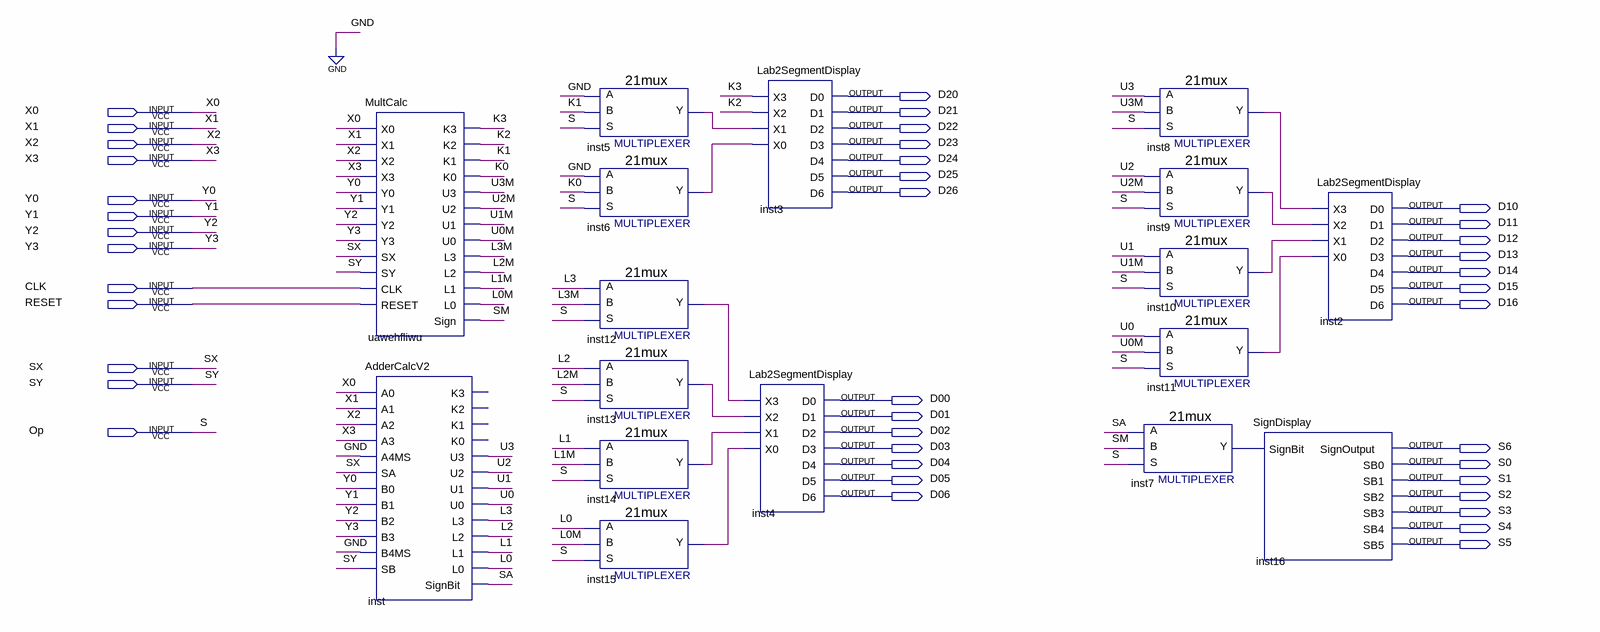
[diagram p0: schematic sheet]
// Quartus schematic CalculatorDisplay.bdf as structural Verilog: 17 symbols, 41 pins
module CalculatorDisplay (
  input  X0,
  input  X1,
  input  X2,
  input  X3,
  input  Y0,
  input  Y1,
  input  Y2,
  input  Y3,
  input  CLK,
  input  RESET,
  input  SX,
  input  SY,
  input  Op,
  output D20,
  output D21,
  output D22,
  output D23,
  output D24,
  output D25,
  output D26,
  output D10,
  output D11,
  output D12,
  output D13,
  output D14,
  output D15,
  output D16,
  output D00,
  output D01,
  output D02,
  output D03,
  output S6,
  output D04,
  output S0,
  output D05,
  output S1,
  output D06,
  output S2,
  output S3,
  output S4,
  output S5
);

  wire inst5_y, inst6_y, inst7_y, inst8_y, inst9_y, inst10_y, inst11_y, inst12_y, inst13_y, inst14_y,
       inst15_y, K0, K1, K2, K3, L0, L0M, L1, L1M, L2, L2M, L3, L3M, SA, SM, U0, U0M, U1, U1M, U2, U2M, U3,
       U3M;

  MultCalc uawehfliwu (
    .X0(X0), .X1(X1), .X2(X2), .X3(X3), .Y0(Y0), .Y1(Y1), .Y2(Y2), .Y3(Y3), .SX(SX), .SY(SY), .CLK(CLK),
    .RESET(RESET), .K3(K3), .K2(K2), .K1(K1), .K0(K0), .U3(U3M), .U2(U2M), .U1(U1M), .U0(U0M), .L3(L3M),
    .L2(L2M), .L1(L1M), .L0(L0M), .Sign(SM));
  AdderCalcV2 inst (
    .A0(X0), .A1(X1), .A2(X2), .A3(X3), .A4MS(1'b0), .SA(SX), .B0(Y0), .B1(Y1), .B2(Y2), .B3(Y3),
    .B4MS(1'b0), .SB(SY), .U3(U3), .U2(U2), .U1(U1), .U0(U0), .L3(L3), .L2(L2), .L1(L1), .L0(L0), .SignBit(SA));  // open: K3, K2, K1, K0
  \21mux  inst5 (.S(Op), .B(K1), .A(1'b0), .Y(inst5_y));
  \21mux  inst6 (.S(Op), .B(K0), .A(1'b0), .Y(inst6_y));
  \21mux  inst12 (.S(Op), .B(L3M), .A(L3), .Y(inst12_y));
  \21mux  inst13 (.S(Op), .B(L2M), .A(L2), .Y(inst13_y));
  \21mux  inst14 (.S(Op), .B(L1M), .A(L1), .Y(inst14_y));
  \21mux  inst15 (.S(Op), .B(L0M), .A(L0), .Y(inst15_y));
  Lab2SegmentDisplay inst3 (
    .X3(K3), .X2(K2), .X1(inst5_y), .X0(inst6_y), .D0(D20), .D1(D21), .D2(D22), .D3(D23), .D4(D24), .D5(D25),
    .D6(D26));
  Lab2SegmentDisplay inst4 (
    .X3(inst12_y), .X2(inst13_y), .X1(inst14_y), .X0(inst15_y), .D0(D00), .D1(D01), .D2(D02), .D3(D03),
    .D4(D04), .D5(D05), .D6(D06));
  \21mux  inst7 (.S(Op), .B(SM), .A(SA), .Y(inst7_y));
  \21mux  inst8 (.S(Op), .B(U3M), .A(U3), .Y(inst8_y));
  \21mux  inst9 (.S(Op), .B(U2M), .A(U2), .Y(inst9_y));
  \21mux  inst10 (.S(Op), .B(U1M), .A(U1), .Y(inst10_y));
  \21mux  inst11 (.S(Op), .B(U0M), .A(U0), .Y(inst11_y));
  SignDisplay inst16 (.SignBit(inst7_y), .SignOutput(S6), .SB0(S0), .SB1(S1), .SB2(S2), .SB3(S3), .SB4(S4), .SB5(S5));
  Lab2SegmentDisplay inst2 (
    .X3(inst8_y), .X2(inst9_y), .X1(inst10_y), .X0(inst11_y), .D0(D10), .D1(D11), .D2(D12), .D3(D13),
    .D4(D14), .D5(D15), .D6(D16));

  // Other names for the same wires on the sheet: S = Op
endmodule
